# EAGLE design RPi_GPIO (EAGLE 9.5.2)
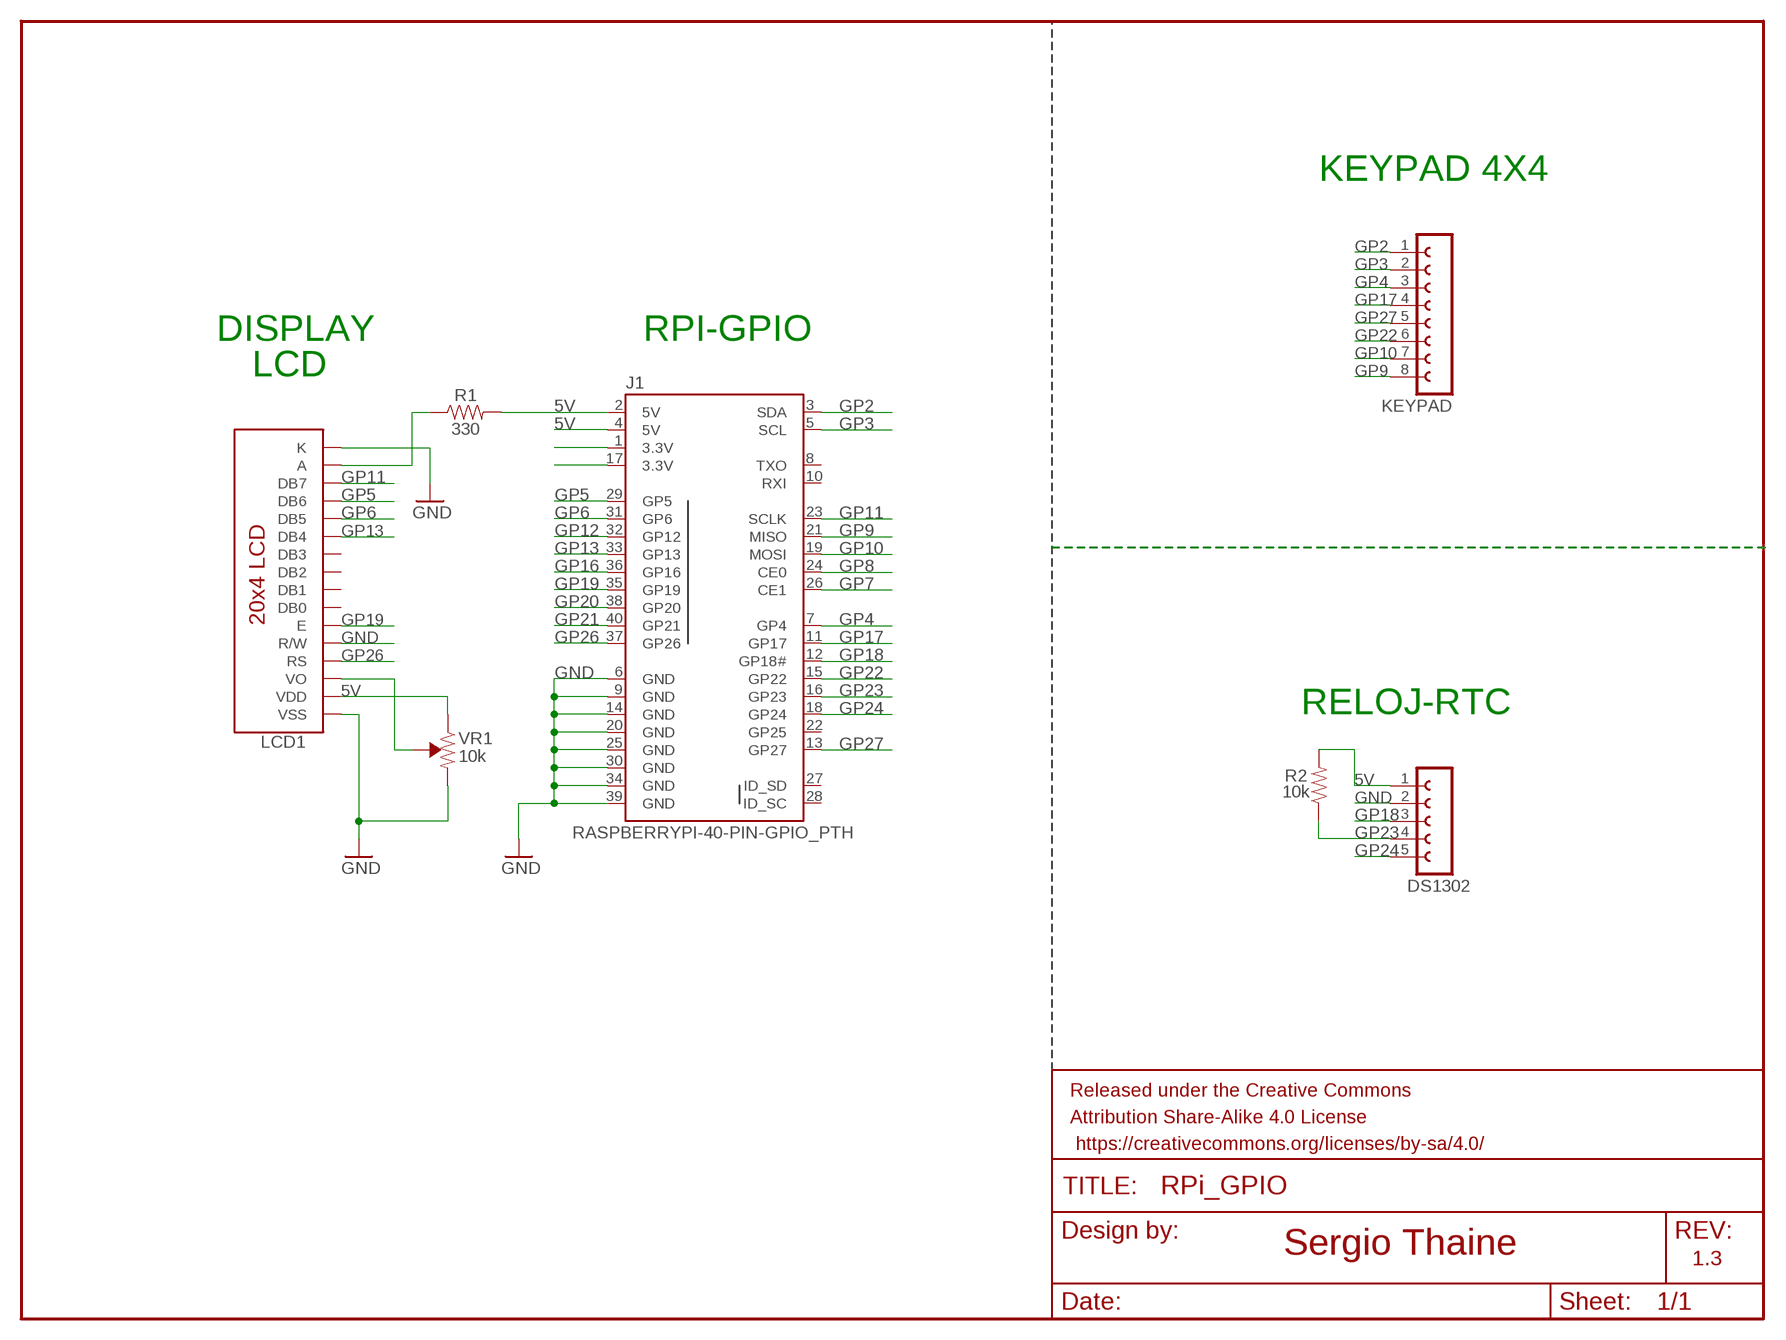
[diagram p0: schematic, sheet 1]

## Parts
DS1302  FE05-1  [FE05-1]
FRAME1  FRAME-LETTERNO_PACKAGE  [DUMMY]
J1  RASPBERRYPI-40-PIN-GPIO_PTH  [2X20_SHROUDED]
KEYPAD  FE08-1  [FE08]
LCD1  LCD-16X2NOHOLES  [LCD-16X2_NOHOLESNOSILK]
R1  330  1KOHM-HORIZ-1/4W-1%  [AXIAL-0.3]
R2  10k  10KOHM-HORIZ-1/4W-1%  [AXIAL-0.3]
VR1  10k  TRIMPOT-PTH-10MM-KNOB-1/2W-10%  [TRIMPOT-PTH-3386U]

## Nets
5V [supply]: DS1302.1 J1.2(5V) J1.4(5V) LCD1.2(VDD) R1.P$2 R2.P$2 VR1.3(CW)
GND [supply]: DS1302.2 J1.6(GND) J1.9(GND) J1.14(GND) J1.20(GND) J1.25(GND) J1.30(GND) J1.34(GND) J1.39(GND) LCD1.1(VSS) LCD1.5(R/W) LCD1.16(K) VR1.1(CCW)
GP2: J1.3(SDA) KEYPAD.1
GP3: J1.5(SCL) KEYPAD.2
GP4: J1.7(GP4) KEYPAD.3
GP5: J1.29(GP5) LCD1.13(DB6)
GP6: J1.31(GP6) LCD1.12(DB5)
GP7: J1.26(CE1)
GP8: J1.24(CE0)
GP9: J1.21(MISO) KEYPAD.8
GP10: J1.19(MOSI) KEYPAD.7
GP11: J1.23(SCLK) LCD1.14(DB7)
GP12: J1.32(GP12)
GP13: J1.33(GP13) LCD1.11(DB4)
GP16: J1.36(GP16)
GP17: J1.11(GP17) KEYPAD.4
GP18: DS1302.3 J1.12(GP18#)
GP19: J1.35(GP19) LCD1.6(E)
GP20: J1.38(GP20)
GP21: J1.40(GP21)
GP22: J1.15(GP22) KEYPAD.6
GP23: DS1302.4 J1.16(GP23) R2.P$1
GP24: DS1302.5 J1.18(GP24)
GP26: J1.37(GP26) LCD1.4(RS)
GP27: J1.13(GP27) KEYPAD.5
N$1: J1.1(3.3V)
N$2: J1.17(3.3V)
N$3: LCD1.3(VO) VR1.2(WIPER)
N$14: LCD1.15(A) R1.P$1
Unconnected: J1.8(TXO) J1.10(RXI) J1.22(GP25) J1.27(ID_SD) J1.28(ID_SC) LCD1.7(DB0) LCD1.8(DB1) LCD1.9(DB2) LCD1.10(DB3)

## Notes on the sheet
- KEYPAD 4X4
- DISPLAY | RPI-GPIO
- LCD
- RELOJ-RTC
- Sergio Thaine
- 1.3

## Library data of the parts
DS1302 = con-lsta:FE05-1: FEMALE HEADER; OC_FARNELL: unknown; OC_NEWARK: unknown
FRAME1 = SparkFun-Aesthetics:FRAME-LETTER: Schematic Frame - Letter Standard 8.5x11 US Letter frame; DESIGNER: Nobody; VERSION: v01
J1 = SparkFun-Connectors:RASPBERRYPI-40-PIN-GPIO: Raspberry Pi GPIO Header 2x20 pin connector, as found on B, B+, A+ models. Both shrouded PTH and SMT versions available. SparkFun Products: GPIO Shrouded Header <https://www.sparkfun.com/products/13054>- PTH SparkFun Pi Wedge (Preassembled) <https://www.sparkfun.com/products/13717>; PROD_ID: CONN-12263; SF_ID: PRT-13054
KEYPAD = con-lsta:FE08-1: FEMALE HEADER; OC_FARNELL: unknown; OC_NEWARK: unknown
LCD1 = LCD24X4:LCD-16X2: Standard text-only 16x2 parallel input LCD Basic 16 character by 2 line display. Typically utilizes the extremely common HD44780 parallel interface chipset SparkFun Products: Basic 16x2 Green <https://www.sparkfun.com/products/255> Basic 8x2 Green <https://www.sparkfun.com/products/11122>; SF_ID: LCD-00255
R1 = SparkFun-Resistors:1KOHM: 1kΩ resistor A resistor is a passive two-terminal electrical component that implements electrical resistance as a circuit element. Resistors act to reduce current flow, and, at the same time, act to lower voltage levels within circuits. - Wikipedia; PROD_ID: RES-12182; VALUE: 1k
R2 = SparkFun-Resistors:10KOHM: 10kΩ resistor A resistor is a passive two-terminal electrical component that implements electrical resistance as a circuit element. Resistors act to reduce current flow, and, at the same time, act to lower voltage levels within circuits. - Wikipedia; PROD_ID: RES-12183
VR1 = SparkFun-Resistors:TRIMPOT: Trimming Potentiometer (Trimpot) Three-terminal potentiometers, with an adjustable wiper and two adjustable resistors. A pot can be used to create a configurable voltage divider, or as a variable resistor. "Trimpots" are a subset of potentiometers, usually intended for "set-and-forget" applications. They're often more delicate than standard potentiometers - rated for fewer turns. Variants PTH-KNOB - PTH Trimpot w/ finger-adjustable knob Trimpot 10K with Knob <https://www.sparkfun.com/products/9806> (COM-09806) Datasheet <http://www.sparkfun.com/datasheets/Components/General/TSR-3386.pdf> SMD-3MM-CLOSED-FRAME - SMD 3mm Square Closed-Frame Trimpot Used on e.g. EasyDriver - Stepper Motor Driver <https://www.sparkfun.com/products/12779> Datasheet <http://www.bitechnologies.com/pdfs/22.pdf> (22AR10KTR) SMD-5MM - SMD 5mm Square Closed-Frame Trimpot Used on e.g. IOIO-OTG - V2.2 <https://www.sparkfun.com/products/13613> Datasheet <http://www.vishay.com/docs/51008/ts53.pdf> (TS53YL502MR10) SMD-3MM-1/10W-25% - 3mm Square Open-Frame Trimpot Used on e.g. SparkFun Shapeoko <https://www.sparkfun.com/products/13899> Datasheet <http://www.bourns.com/docs/Product-Datasheets/TC33.pdf> (TC33X-2-103E); PROD_ID: RES-09730; SF_SKU: COM-09806

## Net classes
1 supply: width 0.61 mm, clearance 0.381 mm

## Board
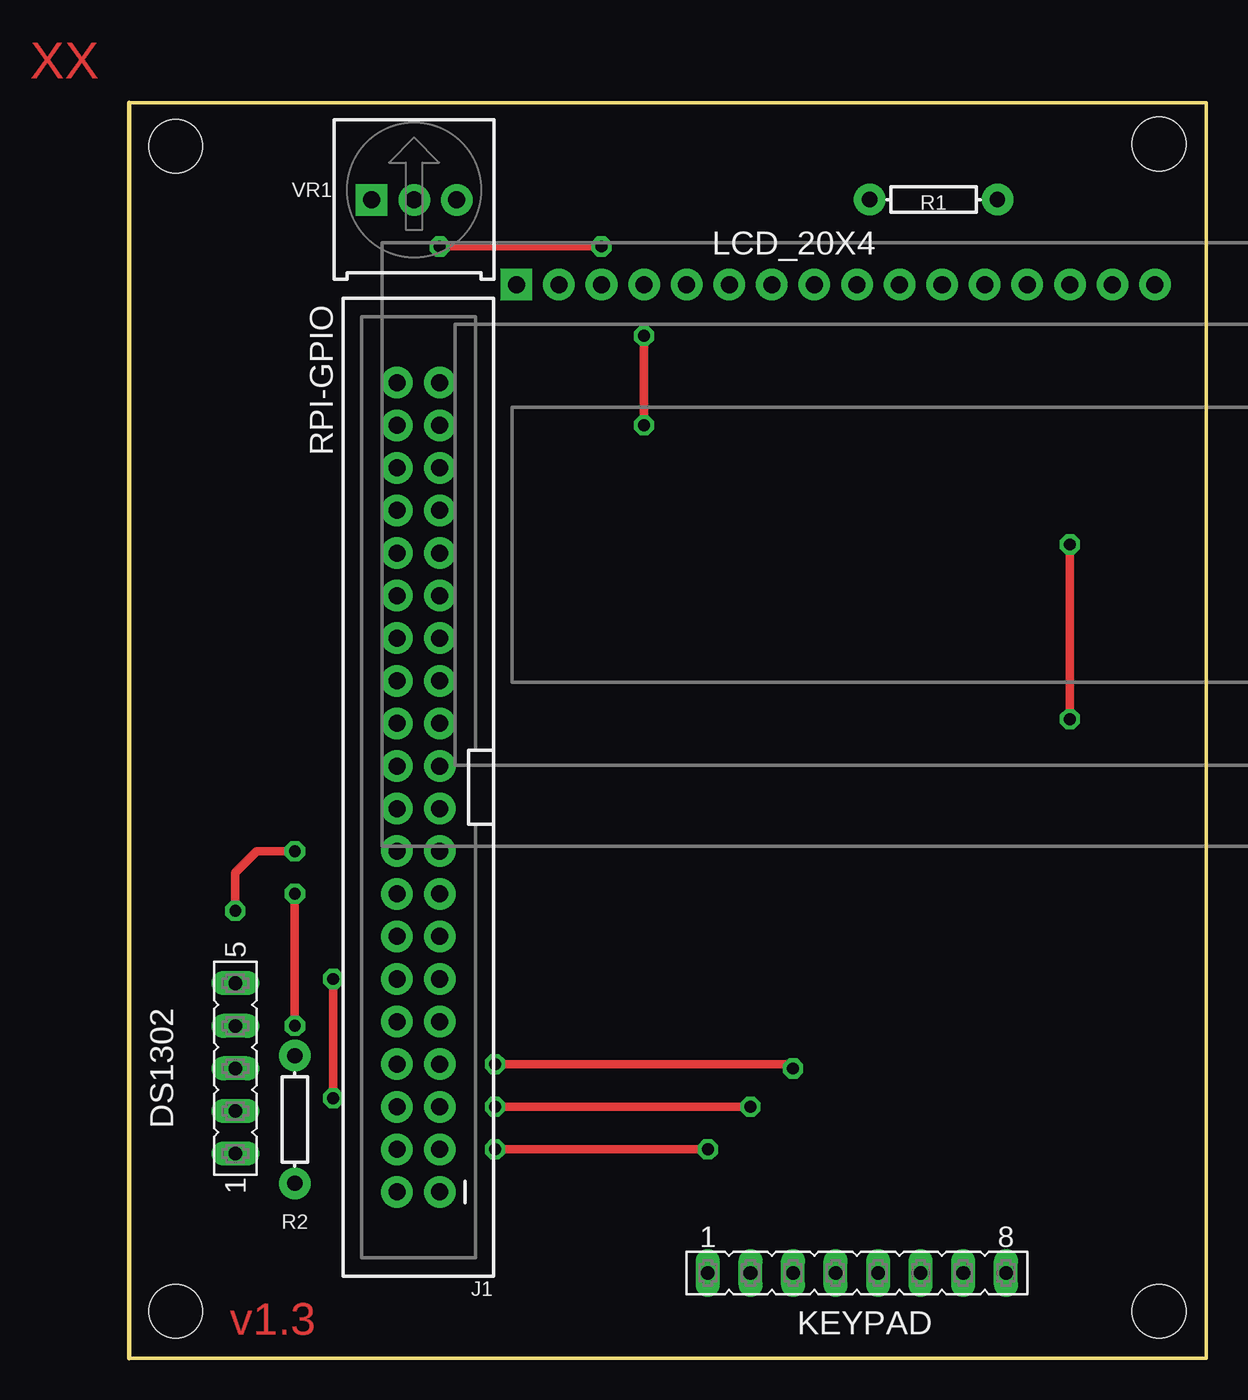
[diagram p1: board, top side]
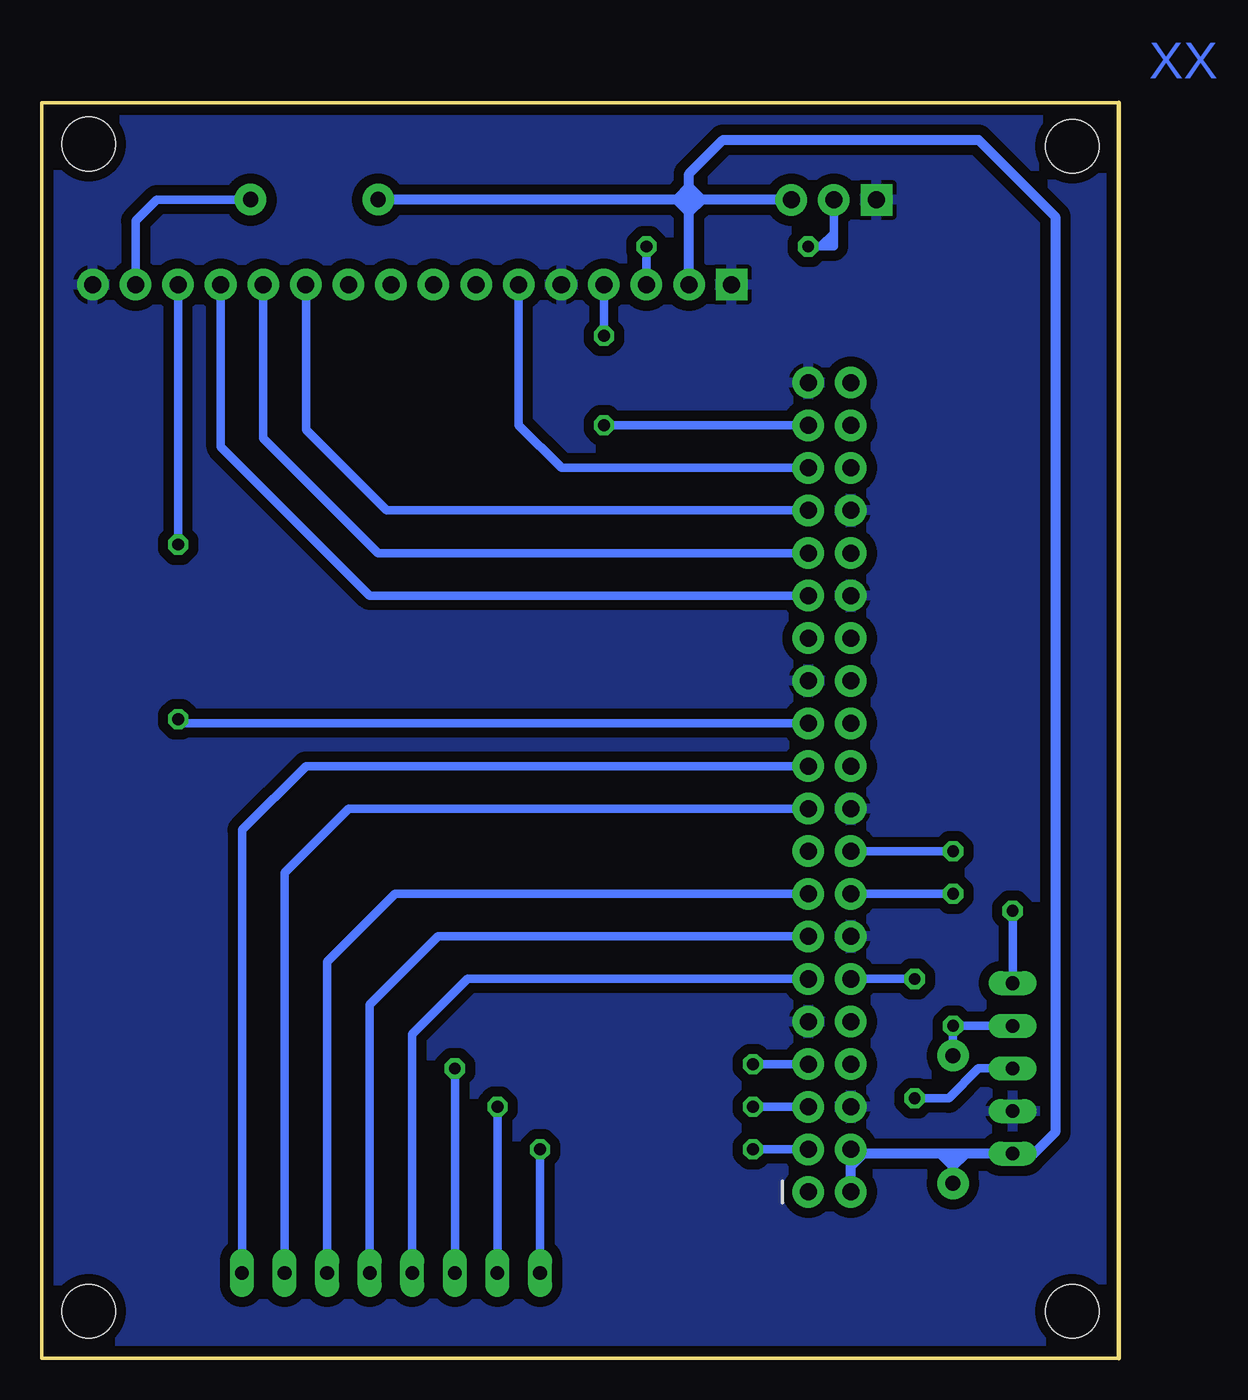
[diagram p2: board, bottom side, seen from below]

Size 64.25 x 74.85 mm. Coordinates in mm from the lower left corner, seen from the top.
Outline: 64.25,0 64.25,74.85 0,74.85 0,0 64.25,0
Copper layers (1*16): Top 0.035mm / dielectric 1.5mm / Bottom 0.035mm
Design rules "SparkFun *": minimum track width 20mil, minimum drill 0.69976875mm, track to track 16mil, track to pad 16mil, pad to pad 10mil, via to via 10mil, smd to smd 8mil, copper to edge 10mil, drill to drill 8mil, minimum pad ring 12mil, minimum via ring 10mil, stop-mask expansion 4mil, vias tented up to drill 25mil, thermal gap 10mil
Holes 3.2 mm at 2.78,2.79 61.46,2.79 2.78,72.26 61.46,72.39

### Footprints (pad centres in the part's own frame; a part is rotated, then mirrored left to right if it is on the bottom)
FE05-1 = drill 0.813 long: 1 -5.08,0; 2 -2.54,0; 3 0,0; 4 2.54,0; 5 5.08,0
2X20_SHROUDED = drill 1.016 pad 1.88: 1 -1.27,24.13; 2 1.27,24.13; 3 -1.27,21.59; 4 1.27,21.59; 5 -1.27,19.05; 6 1.27,19.05; 7 -1.27,16.51; 8 1.27,16.51; 9 -1.27,13.97; 10 1.27,13.97; 11 -1.27,11.43; 12 1.27,11.43; 13 -1.27,8.89; 14 1.27,8.89; 15 -1.27,6.35; 16 1.27,6.35; 17 -1.27,3.81; 18 1.27,3.81; 19 -1.27,1.27; 20 1.27,1.27; 21 -1.27,-1.27; 22 1.27,-1.27; 23 -1.27,-3.81; 24 1.27,-3.81; 25 -1.27,-6.35; 26 1.27,-6.35; 27 -1.27,-8.89; 28 1.27,-8.89; 29 -1.27,-11.43; 30 1.27,-11.43; 31 -1.27,-13.97; 32 1.27,-13.97; 33 -1.27,-16.51; 34 1.27,-16.51; 35 -1.27,-19.05; 36 1.27,-19.05; 37 -1.27,-21.59; 38 1.27,-21.59; 39 -1.27,-24.13; 40 1.27,-24.13
FE08 = drill 0.813 long: 1 -8.89,0; 2 -6.35,0; 3 -3.81,0; 4 -1.27,0; 5 1.27,0; 6 3.81,0; 7 6.35,0; 8 8.89,0
LCD-16X2_NOHOLESNOSILK = drill 1.016 pad 1.88 square: 1 -32,15.5 | drill 1.016 pad 1.88: 2 -29.46,15.5; 3 -26.92,15.5; 4 -24.38,15.5; 5 -21.84,15.5; 6 -19.3,15.5; 7 -16.76,15.5; 8 -14.22,15.5; 9 -11.68,15.5; 10 -9.14,15.5; 11 -6.6,15.5; 12 -4.06,15.5; 13 -1.52,15.5; 14 1.02,15.5; 15 3.56,15.5; 16 6.1,15.5
AXIAL-0.3 = drill 0.9 pad 1.88: P$1 -3.81,0; P$2 3.81,0
TRIMPOT-PTH-3386U = drill 1.016 pad 1.88 square: 1 -2.54,-0.015 | drill 1.016 pad 1.88: 2 0,-0.015; 3 2.54,-0.015

### Placement (x,y rotation side)
DS1302  6.34,17.27 90 top
FRAME1  -1.28,0 0 top
J1  17.26,34.04 180 top
KEYPAD  43.42,5.08 0 top
LCD1  55.11,48.51 0 top
R1  48,69.09 180 top
R2  9.9,14.22 270 top
VR1  17.01,69.09 0 top

### Tracks (layer width: path | path; a pad name or v marks a point on that pad's centre or on a via)
5V
  Bottom 0.61: LCD1.2 25.64,68.33 | 25.64,68.33 25.64,69.09 | 25.64,69.09 25.64,69.85 | 25.64,69.85 25.64,70.61 23.61,72.64 8.37,72.64 3.8,68.07 3.8,13.46 5.07,12.19 DS1302.1 9.13,12.19 | 24.88,69.09 25.64,69.09 | 25.64,69.09 26.41,69.09 | 26.41,69.09 R1.P$2 | 24.88,69.09 25.64,69.85 | 24.88,69.09 25.64,68.33 | 25.64,69.85 26.41,69.09 | 26.41,69.09 25.64,68.33 | VR1.3 24.87,69.07 24.88,69.09 | 9.13,12.19 9.9,12.19 | 9.9,12.19 10.66,12.19 | 10.66,12.19 15.23,12.19 | 15.23,12.19 15.74,12.19 J1.4 15.99,11.43 | J1.2 15.99,11.43 | 15.23,12.19 15.99,11.43 | R2.P$2 9.9,11.43 | 9.9,11.43 9.9,12.19 | 9.9,11.43 9.13,12.19 | 9.9,11.43 10.66,12.19
GND
  pour Bottom (isolate 0.61): 0.5,74.42 12.69,74.42 63.49,74.42 63.74,74.42 63.74,26.16 63.74,0.51 51.04,0.51 0.5,0.51
GP2  (via drill 0.7)
  Top 0.508: v21.83,12.45 v34.53,12.45
  Bottom 0.508: KEYPAD.1 34.53,9.4 34.53,9.91 v34.53,12.45 | J1.3 v21.83,12.45
GP3  (via drill 0.7)
  Top 0.508: v21.83,14.99 v37.07,14.99
  Bottom 0.508: KEYPAD.2 37.07,12.45 37.07,12.7 v37.07,14.99 | J1.5 v21.83,14.99
GP4  (via drill 0.7)
  Top 0.508: v21.83,17.53 39.36,17.53 v39.61,17.27
  Bottom 0.508: KEYPAD.3 39.61,14.48 39.61,14.73 v39.61,17.27 | J1.7 v21.83,17.53
GP5
  Bottom 0.508: J1.29 44.69,45.47 53.58,54.36 LCD1.13
GP6
  Bottom 0.508: J1.31 44.19,48.01 51.04,54.86 LCD1.12
GP9
  Bottom 0.508: J1.21 48.5,35.31 52.31,31.5 KEYPAD.8
GP10
  Bottom 0.508: J1.19 45.96,32.77 49.77,28.96 KEYPAD.7
GP11  (via drill 0.7)
  Top 0.508: v56.12,38.1 v56.12,48.51
  Bottom 0.508: J1.23 55.87,37.85 v56.12,38.1 | v56.12,48.51 LCD1.14
GP13
  Bottom 0.508: J1.33 43.68,50.55 48.5,55.37 LCD1.11
GP17
  Bottom 0.508: J1.11 38.85,22.61 42.15,19.3 KEYPAD.4
GP18  (via drill 0.7)
  Top 0.508: v12.18,15.49 v12.18,22.61
  Bottom 0.508: v12.18,22.61 J1.12 | DS1302.3 8.37,17.27 10.15,15.49 v12.18,15.49
GP19
  Bottom 0.508: J1.35 33.26,53.09 35.8,55.63 LCD1.6
GP22
  Bottom 0.508: J1.15 43.17,27.69 47.23,23.62 KEYPAD.6
GP23  (via drill 0.7)
  Top 0.508: v9.9,27.69 v9.9,19.81
  Bottom 0.508: J1.16 v9.9,27.69 | DS1302.4 v9.9,19.81 R2.P$1
GP24  (via drill 0.7)
  Top 0.508: v9.9,30.23 7.61,30.23 6.34,28.96 v6.34,26.67
  Bottom 0.508: J1.18 v9.9,30.23 | v6.34,26.67 DS1302.5
GP26  (via drill 0.7)
  Top 0.508: v30.72,55.63 v30.72,60.96
  Bottom 0.508: J1.37 v30.72,55.63 | v30.72,60.96 LCD1.4
GP27
  Bottom 0.508: J1.13 40.63,25.15 44.69,21.08 KEYPAD.5
N$3  (via drill 0.7)
  Top 0.508: v18.53,66.29 v28.18,66.29
  Bottom 0.508: v28.18,66.29 v28.19,66.29 LCD1.3 | v18.53,66.29 17.77,66.29 | 17.77,66.29 17.01,66.29 17.01,67.06 | 17.01,67.06 VR1.2 | 17.01,67.06 17.77,66.29
N$14
  Bottom 0.508: R1.P$1 57.39,69.09 58.67,67.81 LCD1.15

### Text on the board
Top: XX | XX | v1.3 | XX | XX
Bottom: XX | XX | XX | XX
tNames: LCD_20X4 | RPI-GPIO